# Altium schematic sheet 14SD.SchDoc: 14SD  Sheet for DS214SD
size A3; Organization: LES-TV; Address1: Moscow; Address2: www.les.ru; Revision: 4.0; SheetNumber: 2; SheetTotal: 2
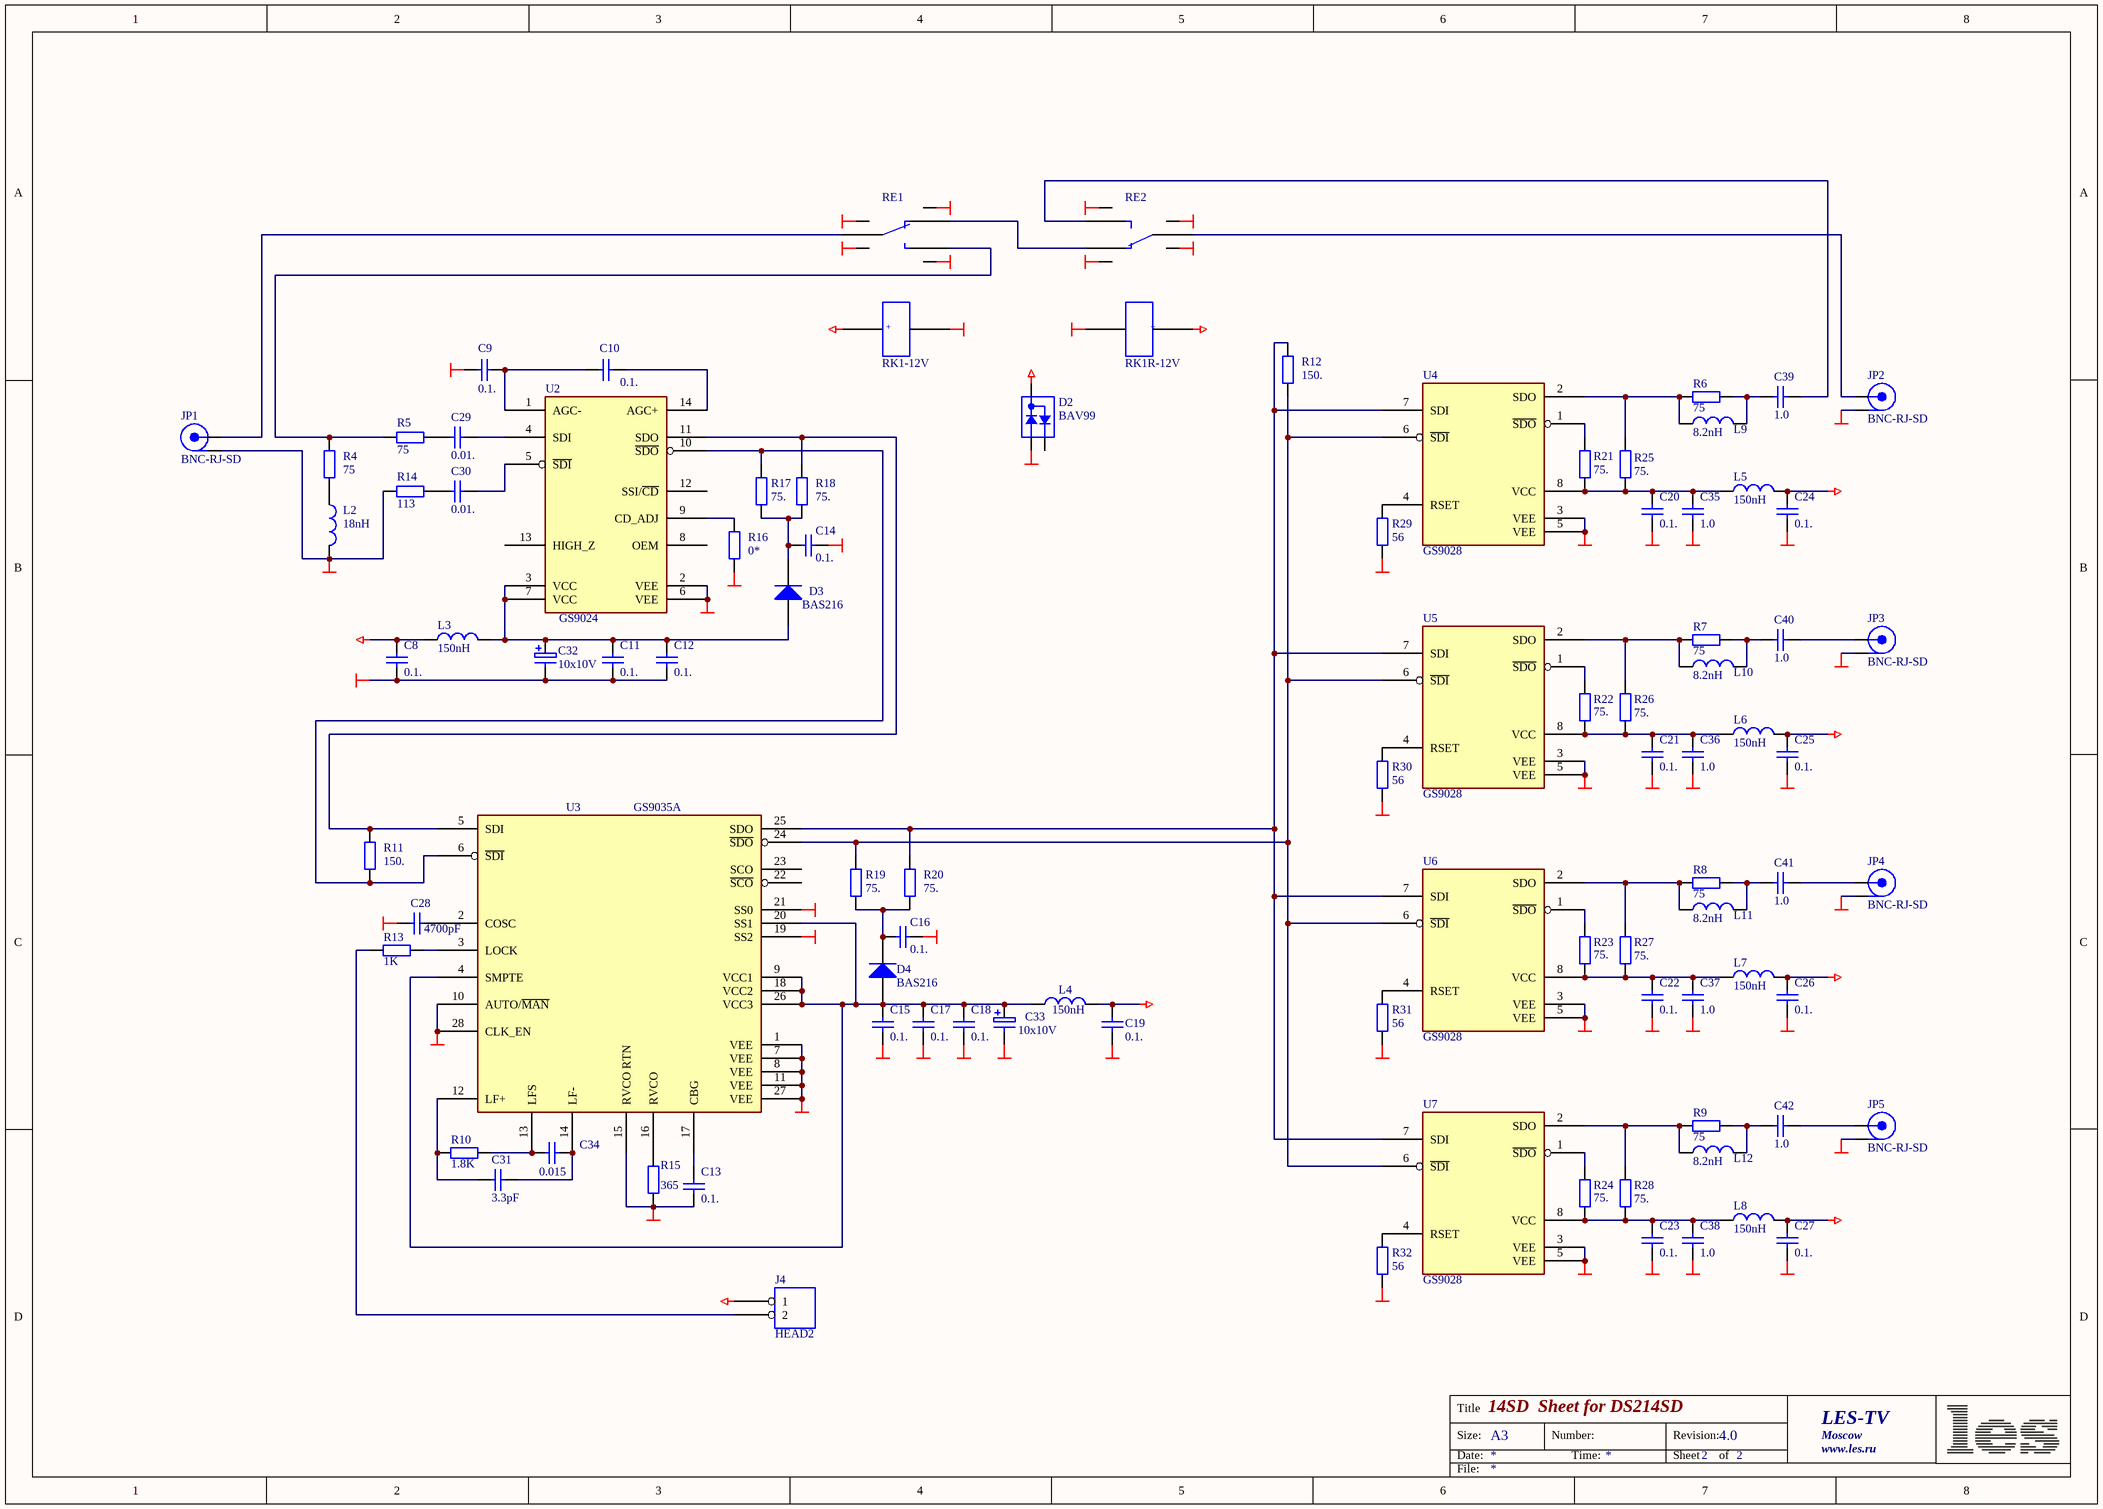
[diagram p0: 14SD.SchDoc]

## Parts
C8  0.1.  [C0402]
C9  0.1.  [C0402]
C10  0.1.  [C0402]
C11  0.1.  [C0402]
C12  0.1.  [C0402]
C13  0.1.  [C0402]
C14  0.1.  [C0402]
C15  0.1.  [C0402]
C16  0.1.  [C0402]
C17  0.1.  [C0402]
C18  0.1.  [C0402]
C19  0.1.  [C0402]
C20  0.1.  [C0402]
C21  0.1.  [C0402]
C22  0.1.  [C0402]
C23  0.1.  [C0402]
C24  0.1.  [C0402]
C25  0.1.  [C0402]
C26  0.1.  [C0402]
C27  0.1.  [C0402]
C28  4700pF  [C0805]
C29  0.01.  [C0402]
C30  0.01.  [C0402]
C31  3.3pF  [C0805]
C32  10x10V  [TA1206]
C33  10x10V  [TA1206]
C34  0.015  [C0805]
C35  1.0  [C0805]
C36  1.0  [C0805]
C37  1.0  [C0805]
C38  1.0  [C0805]
C39  1.0  [C0805]
C40  1.0  [C0805]
C41  1.0  [C0805]
C42  1.0  [C0805]
D2  BAV99  [SOT23-BAV99]
D3  BAS216  [D0805]
D4  BAS216  [D0805]
J4  HEAD2  [2SIP100]
JP1  BNC-RJ-SD  [BNC_RJ]
JP2  BNC-RJ-SD  [BNC_RJ]
JP3  BNC-RJ-SD  [BNC_RJ]
JP4  BNC-RJ-SD  [BNC_RJ]
JP5  BNC-RJ-SD  [BNC_RJ]
L2  18nH  [L0805]
L3  150nH  [L0805]
L4  150nH  [L0805]
L5  150nH  [L0805]
L6  150nH  [L0805]
L7  150nH  [L0805]
L8  150nH  [L0805]
L9  8.2nH  [L0805]
L10  8.2nH  [L0805]
L11  8.2nH  [L0805]
L12  8.2nH  [L0805]
R4  75  [R0805]
R5  75  [R0805]
R6  75  [R0805]
R7  75  [R0805]
R8  75  [R0805]
R9  75  [R0805]
R10  1.8K  [R0805]
R11  150.  [R0402]
R12  150.  [R0402]
R13  1K  [R0805]
R14  113  [R0805]
R15  365  [R0805]
R16  0*  [R0402]
R17  75.  [R0402]
R18  75.  [R0402]
R19  75.  [R0402]
R20  75.  [R0402]
R21  75.  [R0402]
R22  75.  [R0402]
R23  75.  [R0402]
R24  75.  [R0402]
R25  75.  [R0402]
R26  75.  [R0402]
R27  75.  [R0402]
R28  75.  [R0402]
R29  56  [R0805]
R30  56  [R0805]
R31  56  [R0805]
R32  56  [R0805]
RE1  RK1-12V  [RELAY RK]
RE2  RK1R-12V  [RELAY RK]
U2  GS9024  [SO-14]
U3  GS9035A  [PLCC-28]
U4  GS9028  [SO-8]
U5  GS9028  [SO-8]
U6  GS9028  [SO-8]
U7  GS9028  [SO-8]

## Nets
+5V: C8.2 C19.2 C24.2 C25.2 C26.2 C27.2 J4.1 L3.1 L4.2 L5.1 L6.1 L7.1 L8.1
GND: C8.1 C9.1 C11.1 C12.1 C13.1 C14.1 C15.1 C16.1 C17.1 C18.1 C19.1 C20.1 C21.1 C22.1 C23.1 C24.1 C25.1 C26.1 C27.1 C28.1 C32.2 C33.2 C35.1 C36.1 C37.1 C38.1 D2.2(A) JP1.2 JP2.2 JP3.2 JP4.2 JP5.2 L2.2 R14.2 R15.2 R16.1 R29.1 R30.1 R31.1 R32.1 RE1.1(W-) RE1.9 RE1.10 RE1.12 RE1.13 RE2.1(W-) RE2.9 RE2.10 RE2.12 RE2.13 U2.2(VEE) U2.6(VEE) U3.1(VEE) U3.7(VEE) U3.8(VEE) U3.10(AUTO/~{MAN}) U3.11(VEE) U3.15(RVCO_RTN) U3.19(SS2) U3.21(SS0) U3.27(VEE) U3.28(CLK_EN) U4.3(VEE) U4.5(VEE) U5.3(VEE) U5.5(VEE) U6.3(VEE) U6.5(VEE) U7.3(VEE) U7.5(VEE)
REL: D2.1(C) RE1.7(W+) RE2.7(W+)
NetC9_2: C9.2 C10.1 U2.1(AGC-)
NetC10_2: C10.2 U2.14(AGC+)
NetC11_2: C11.2 C12.2 C32.1 D3.1(A) L3.2 U2.3(VCC) U2.7(VCC)
NetC13_2: C13.2 U3.17(CBG)
NetC14_2: C14.2 D3.2(K) R17.1 R18.1
NetC15_2: C15.2 C17.2 C18.2 C33.1 D4.1(A) L4.1 U3.4(SMPTE) U3.9(VCC1) U3.18(VCC2) U3.20(SS1) U3.26(VCC3)
NetC16_2: C16.2 D4.2(K) R19.1 R20.1
NetC20_2: C20.2 C35.2 L5.2 R21.1 R25.1 U4.8(VCC)
NetC21_2: C21.2 C36.2 L6.2 R22.1 R26.1 U5.8(VCC)
NetC22_2: C22.2 C37.2 L7.2 R23.1 R27.1 U6.8(VCC)
NetC23_2: C23.2 C38.2 L8.2 R24.1 R28.1 U7.8(VCC)
NetC28_2: C28.2 U3.2(COSC)
NetC29_1: C29.1 R5.1
NetC29_2: C29.2 U2.4(SDI)
NetC30_1: C30.1 R14.1
NetC30_2: C30.2 U2.5(~{SDI})
NetC31_1: C31.1 R10.2 U3.12(LF+)
NetC31_2: C31.2 C34.2 U3.14(LF-)
NetC34_1: C34.1 R10.1 U3.13(LFS)
NetC39_1: C39.1 RE2.14(NO)
NetC39_2: C39.2 L9.2 R6.2
NetC40_1: C40.1 JP3.1
NetC40_2: C40.2 L10.2 R7.2
NetC41_1: C41.1 JP4.1
NetC41_2: C41.2 L11.2 R8.2
NetC42_1: C42.1 JP5.1
NetC42_2: C42.2 L12.2 R9.2
NetJ4_2: J4.2 R13.2
NetJP1_1: JP1.1 RE1.11(COM)
NetJP2_1: JP2.1 RE2.11(COM)
NetL2_1: L2.1 R4.1
NetL9_1: L9.1 R6.1 R25.2 U4.2(SDO)
NetL10_1: L10.1 R7.1 R26.2 U5.2(SDO)
NetL11_1: L11.1 R8.1 R27.2 U6.2(SDO)
NetL12_1: L12.1 R9.1 R28.2 U7.2(SDO)
NetR4_2: R4.2 R5.2 RE1.8(NO)
NetR11_1: R11.1 R17.2 U2.10(~{SDO}) U3.6(~{SDI})
NetR11_2: R11.2 R18.2 U2.11(SDO) U3.5(SDI)
NetR12_1: R12.1 R19.2 U3.24(~{SDO}) U4.6(~{SDI}) U5.6(~{SDI}) U6.6(~{SDI}) U7.6(~{SDI})
NetR12_2: R12.2 R20.2 U3.25(SDO) U4.7(SDI) U5.7(SDI) U6.7(SDI) U7.7(SDI)
NetR13_1: R13.1 U3.3(LOCK)
NetR15_1: R15.1 U3.16(RVCO)
NetR16_2: R16.2 U2.9(CD_ADJ)
NetR21_2: R21.2 U4.1(~{SDO})
NetR22_2: R22.2 U5.1(~{SDO})
NetR23_2: R23.2 U6.1(~{SDO})
NetR24_2: R24.2 U7.1(~{SDO})
NetR29_2: R29.2 U4.4(RSET)
NetR30_2: R30.2 U5.4(RSET)
NetR31_2: R31.2 U6.4(RSET)
NetR32_2: R32.2 U7.4(RSET)
NetRE1_14: RE1.14(NC) RE2.8(NC)

Not connected (* = marked no-connect by the designer): D2 3(K); U2 8(OEM) 12(SSI/~{CD}) 13(HIGH_Z); U3 22(~{SCO}) 23(SCO)

## Notes on the sheet
- Title
- Size:
- Date:
- A3
- Number:
- Time:
- Revision:
- Sheet
- of
- File:
- (in symbol RELAY RK1) +
- (in symbol RELAY RK1R) +

## Library data of the parts
C8-C31 C34-C42 = Cap: Capacitor; Manufacturer: Generic Components; Class I: Passive; Rule: Undefined; Published: 8-Jun-2000; Revision: July-2002: Re-released for DXP Platform.; Publisher: Altium Limited; Class II: Capacitor
  C8-C27: Value: 0.1.
  C28: Value: 4700pF
  C29 C30: Value: 0.01.
  C31: Value: 3.3pF
  C34: Value: 0.015
  C35-C42: Value: 1.0
C32 C33 = Cap Pol: Polarized Capacitor (Radial); Manufacturer: Generic Components; Class I: Passive; Published: 8-Jun-2000; Revision: July-2002: Re-released for DXP Platform.; Publisher: Altium Limited; Class II: Capacitor; Value: 10x10V
D2 = BAV99: Right: 30; Bottom: 30
D3 D4 = Diode: Default Diode; Manufacturer: Generic Components; Class I: Discrete; Class II: Diode - Switching; Published: 8-Jun-2000; Revision: July-2002: Re-released for DXP Platform.; Publisher: Altium Limited
J4 = HEAD2: Right: 30; Bottom: 30
JP1-JP5 = BNC: Right: 20; Bottom: 20
L2-L12 = INDUCTOR: Right: 20; Bottom: 40
R4-R32 = Res: Resistor; Manufacturer: Generic Components; Class I: Passive; Published: 8-Jun-2000; Revision: July-2002: Re-released for DXP Platform.; Publisher: Altium Limited; Class II: Resistor
  R4-R9: Value: 75
  R10: Value: 1.8K
  R11 R12: Value: 150.
  R13: Value: 1K
  R14: Value: 113
  R15: Value: 365
  R16: Value: 0*
  R17-R28: Value: 75.
  R29-R32: Value: 56
RE1 = RELAY RK1: Right: 20; Bottom: 130
RE2 = RELAY RK1R: Right: 20; Bottom: 130
U2 = GS9024: Right: 90; Bottom: 160
U3 = GS9035A: Right: 210; Bottom: 220
U4-U7 = GS9028: Right: 90; Bottom: 120